# EAGLE schematic soapdis_schematic (EAGLE 9.5.1)
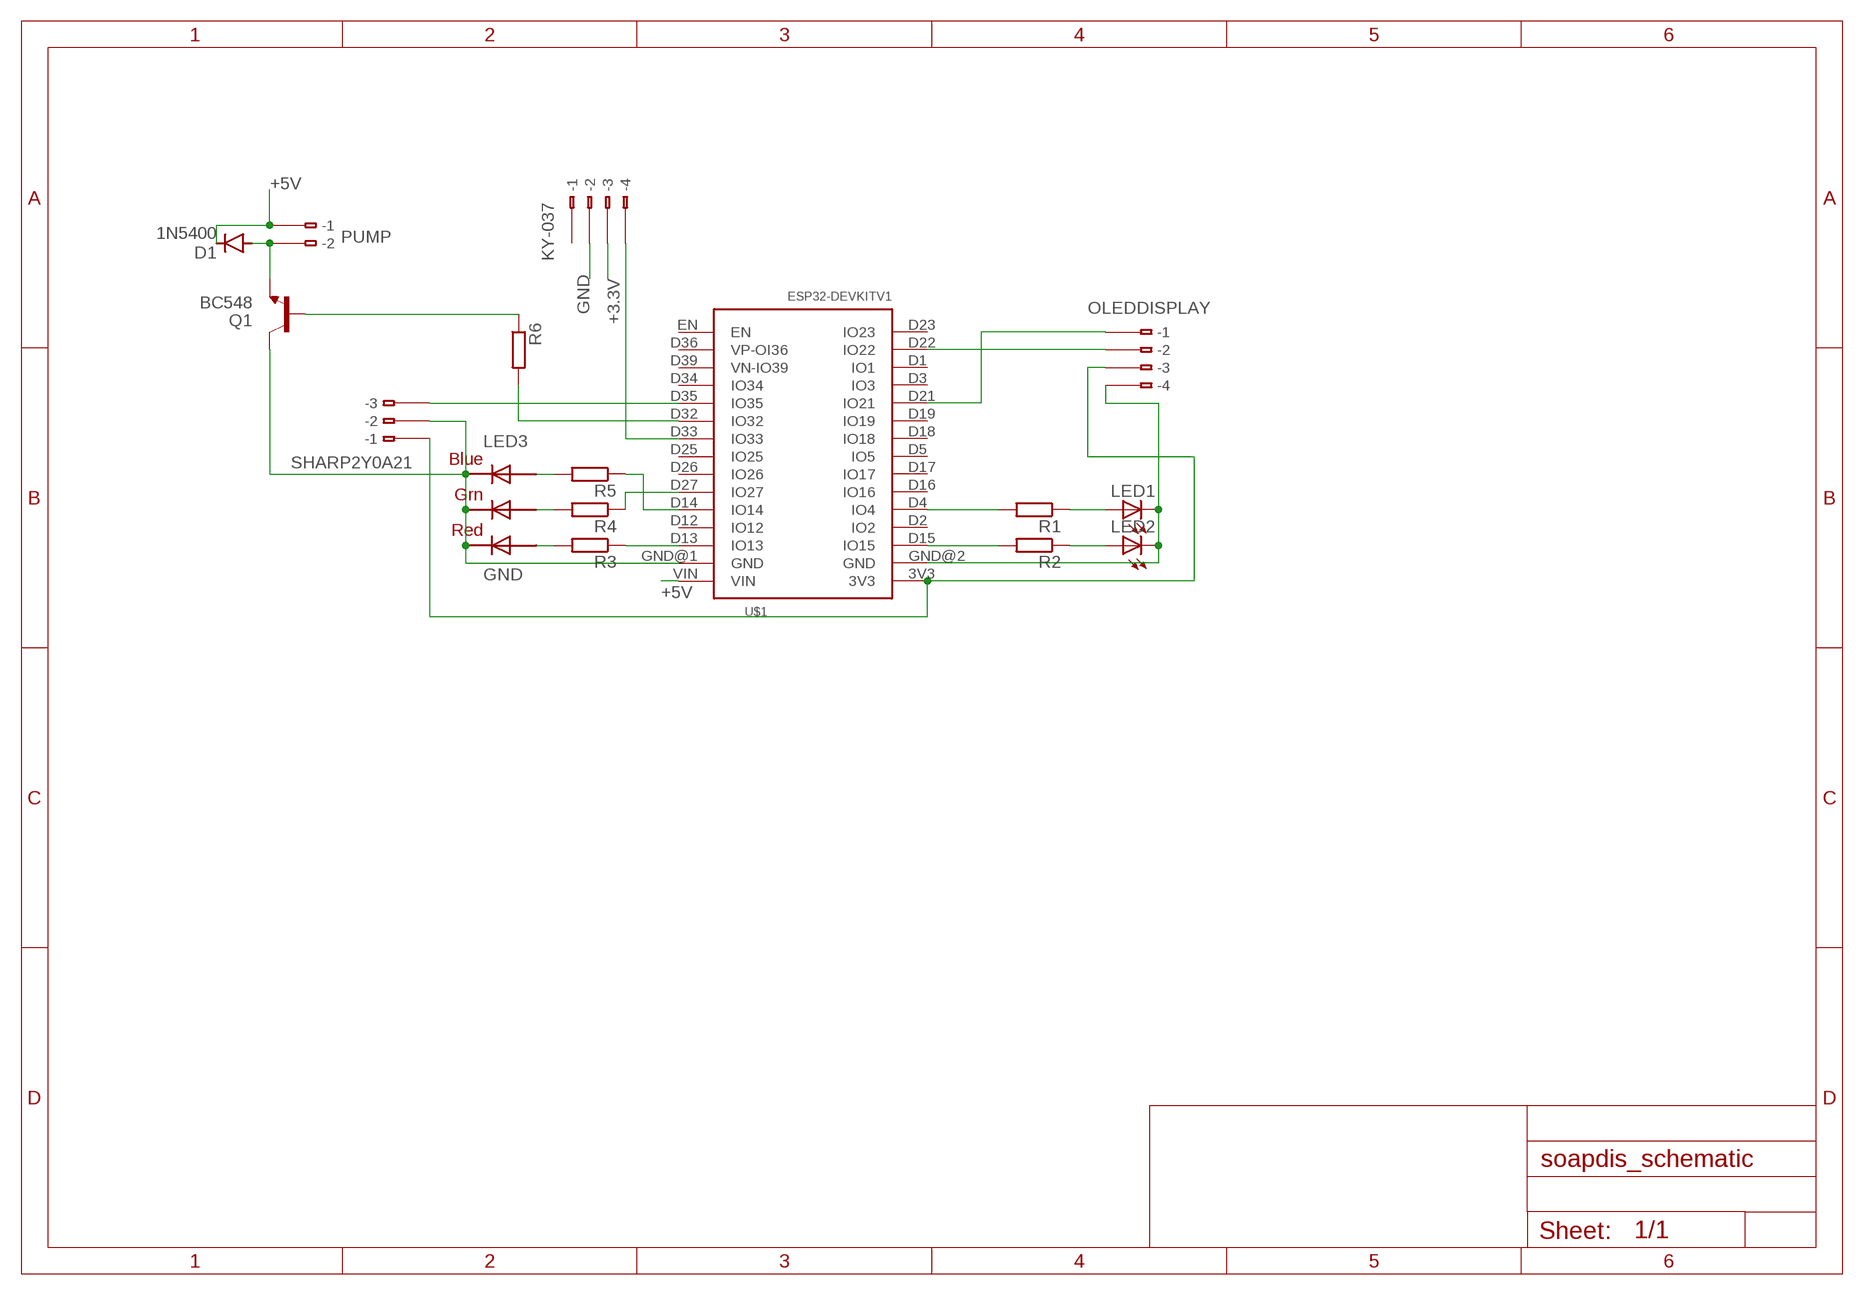
[diagram p0: schematic, sheet 1]

## Parts
D1  1N5400  [DO201-15]
KY-037  233-104  [233-104]
LED1  LED5MM  [LED5MM]
LED2  LED5MM  [LED5MM]
LED3  RGBLED5050  [RGBLED5050]
OLEDDISPLAY  233-104  [233-104]
PUMP  233-102  [233-102]
Q1  BC548  [TO92-EBC]
R1  R-EU_0204/7  [0204/7]
R2  R-EU_0204/7  [0204/7]
R3  R-EU_0204/7  [0204/7]
R4  R-EU_0204/7  [0204/7]
R5  R-EU_0204/7  [0204/7]
R6  R-EU_0204/7  [0204/7]
SHARP2Y0A21  233-103  [233-103]
U$1  ESP32DEVKITV1  [ESP32-DEVKITV1]

## Nets
+3.3V: KY-037.B3(B-3)
+5V: D1.C PUMP.B1(B-1) U$1.VIN
GND: KY-037.B2(B-2) LED3.4(BLUE_C) LED3.5(RED_C) LED3.6(GREEN_C) Q1.C SHARP2Y0A21.B2(B-2) U$1.GND@1(GND)
N$1: R1.2 U$1.D4(IO4)
N$2: R2.2 U$1.D15(IO15)
N$3: LED1.A R1.1
N$4: LED2.A R2.1
N$5: LED1.K(C) LED2.K(C) OLEDDISPLAY.B4(B-4) U$1.GND@2(GND)
N$6: LED3.3(BLUE_A) R5.2
N$7: LED3.1(GREEN_A) R4.2
N$8: LED3.2(RED_A) R3.2
N$9: R5.1 U$1.D14(IO14)
N$10: R4.1 U$1.D27(IO27)
N$11: R3.1 U$1.D13(IO13)
N$12: Q1.B R6.1
N$13: SHARP2Y0A21.B3(B-3) U$1.D35(IO35)
N$14: R6.2 U$1.D32(IO32)
N$15: OLEDDISPLAY.B3(B-3) SHARP2Y0A21.B1(B-1) U$1.3V3
N$16: D1.A PUMP.B2(B-2) Q1.E
N$17: OLEDDISPLAY.B1(B-1) U$1.D21(IO21)
N$18: OLEDDISPLAY.B2(B-2) U$1.D22(IO22)
N$19: KY-037.B4(B-4) U$1.D33(IO33)
Unconnected: KY-037.A1(-1) KY-037.A2(-2) KY-037.A3(-3) KY-037.A4(-4) KY-037.B1(B-1) OLEDDISPLAY.A1(-1) OLEDDISPLAY.A2(-2) OLEDDISPLAY.A3(-3) OLEDDISPLAY.A4(-4) PUMP.A1(-1) PUMP.A2(-2) SHARP2Y0A21.A1(-1) SHARP2Y0A21.A2(-2) SHARP2Y0A21.A3(-3) U$1.D1(IO1) U$1.D2(IO2) U$1.D3(IO3) U$1.D5(IO5) U$1.D12(IO12) U$1.D16(IO16) U$1.D17(IO17) U$1.D18(IO18) U$1.D19(IO19) U$1.D23(IO23) U$1.D25(IO25) U$1.D26(IO26) U$1.D34(IO34) U$1.D36(VP-OI36) U$1.D39(VN-IO39) U$1.EN

## Library data of the parts
D1 = diode:1N5400: DIODE standard rectifier, 3 A, 50 V (Motorola)
KY-037 OLEDDISPLAY = con-wago:233-104: WAGO Cage Clamp; MPN: 233-104; OC_FARNELL: unknown; OC_NEWARK: 28K9046
LED1 LED2 = adafruit:LED: LED OSRAM: - CHIPLED LG R971, LG N971, LY N971, LG Q971, LY Q971, LO R971, LY R971 LH N974, LH R974 LS Q976, LO Q976, LY Q976 LO Q996 - Hyper CHIPLED LW Q18S LB Q993, LB Q99A, LB R99A - SideLED LS A670, LO A670, LY A670, LG A670, LP A670 LB A673, LV A673, LT A673, LW A673 LH A674 LY A675 LS A676, LA A676, LO A676, LY A676, LW A676 LS A679, LY A679, LG A679 - Hyper Micro SIDELED® LS Y876, LA Y876, LO Y876, LY Y876 LT Y87S - SmartLED LW L88C, LW L88S LB L89C, LB L89S, LG L890 LS L89K, LO L89K, LY L89K LS L896, LA L896, LO L896, LY L896 - TOPLED LS T670, LO T670, LY T670, LG T670, LP T670 LSG T670, LSP T670, LSY T670, LOP T670, LYG T670 LG T671, LOG T671, LSG T671 LB T673, LV T673, LT T673, LW T673 LH T674 LS T676, LA T676, LO T676, LY T676, LB T676, LH T676, LSB T676, LW T676 LB T67C, LV T67C, LT T67C, LS T67K, LO T67K, LY T67K, LW E67C LS E67B, LA E67B, LO E67B, LY E67B, LB E67C, LV E67C, LT E67C LW T67C LS T679, LY T679, LG T679 LS T770, LO T770, LY T770, LG T770, LP T770 LB T773, LV T773, LT T773, LW T773 LH T774 LS E675, LA E675, LY E675, LS T675 LS T776, LA T776, LO T776, LY T776, LB T776 LHGB T686 LT T68C, LB T68C - Hyper Mini TOPLED® LB M676 - Mini TOPLED Santana® LG M470 LS M47K, LO M47K, LY M47K Source: http://www.osram.convergy.de/
LED3 = adafruit:RGBLED: For 5050 RGB LEDs, the order of the LEDs may vary from one manufacturer to another!
PUMP = con-wago:233-102: WAGO Cage Clamp; MPN: 233-102; OC_FARNELL: unknown; OC_NEWARK: 28K9044
Q1 = transistor-npn:BC548*: NPN Transistor
R1-R6 = rcl:R-EU_: RESISTOR, European symbol; SPICEPREFIX: R
SHARP2Y0A21 = con-wago:233-103: WAGO Cage Clamp; MPN: 233-103; OC_FARNELL: unknown; OC_NEWARK: 28K9045
U$1 = ESP32-DEVKITV1:ESP32DEVKITV1